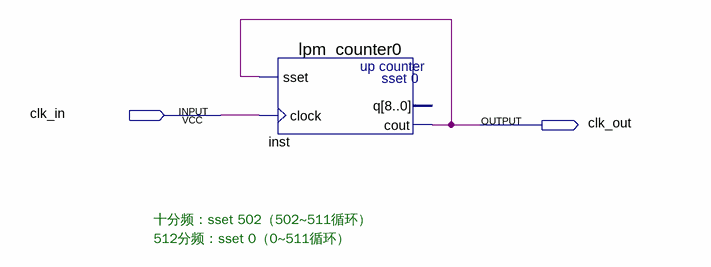
[diagram p0: schematic sheet]
// Quartus schematic Divider.bdf as structural Verilog: 1 symbols, 2 pins
module Divider (
  input  clk_in,
  output clk_out
);

  lpm_counter0 inst (.sset(clk_out), .clock(clk_in), .cout(clk_out));  // open: q

  // Notes on the sheet:
  //   十分频：sset 502（502~511循环）
  //   512分频：sset 0（0~511循环）
endmodule
